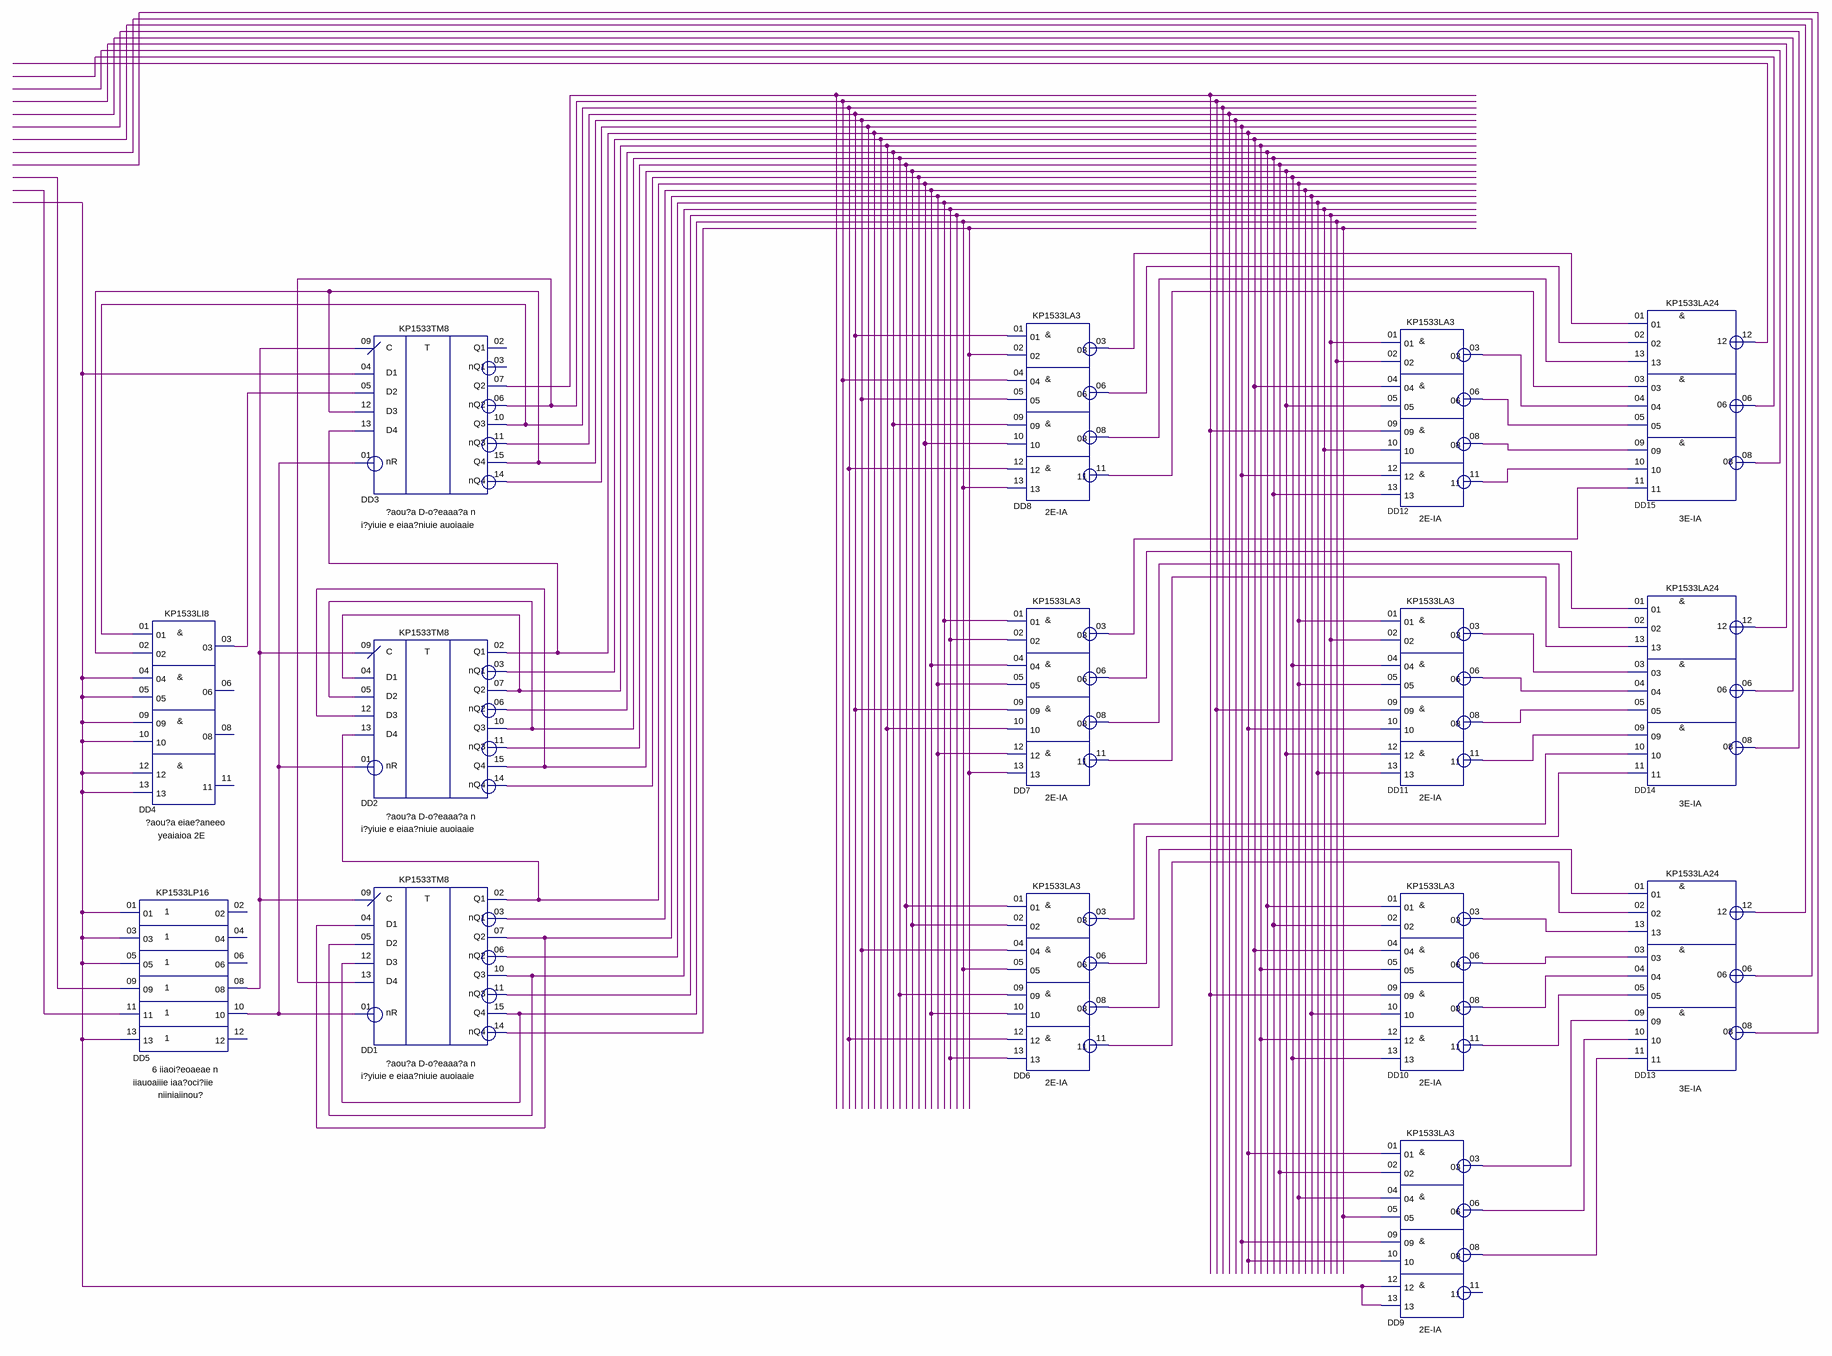
[diagram p0: schematic sheet]
// Quartus schematic principles.bdf as structural Verilog: 15 symbols, 0 pins
module principles (
);

  wire DD1_nq1, DD1_nq2, DD1_nq3, DD1_nq4, DD1_q1, DD1_q2, DD1_q3, DD1_q4, DD2_nq1, DD2_nq2, DD2_nq3,
       DD2_nq4, DD2_q1, DD2_q2, DD2_q3, DD2_q4, DD3_nq2, DD3_nq3, DD3_nq4, DD3_q2, DD3_q3, DD3_q4, DD4_03,
       DD5_08, DD5_10, DD6_03, DD6_06, DD6_08, DD6_11, DD7_03, DD7_06, DD7_08, DD7_11, DD8_03, DD8_06,
       DD8_08, DD8_11, DD9_03, DD9_06, DD9_08, DD10_03, DD10_06, DD10_08, DD10_11, DD11_03, DD11_06, DD11_08,
       DD11_11, DD12_03, DD12_06, DD12_08, DD12_11, DD13_06, DD13_08, DD13_12, DD14_06, DD14_08, DD14_12,
       DD15_06, DD15_08, DD15_12, undriven, undriven_2, undriven_3;

  KP1533LP16 DD5 (
    .\01 (undriven_3), .\03 (undriven_3), .\05 (undriven_3), .\09 (undriven), .\11 (undriven_2),
    .\13 (undriven_3), .\08 (DD5_08), .\10 (DD5_10));  // open: 02, 04, 06, 12
  KP1533LI8 DD4 (
    .\01 (DD3_q3), .\02 (DD3_q4), .\04 (undriven_3), .\05 (undriven_3), .\09 (undriven_3), .\10 (undriven_3),
    .\12 (undriven_3), .\13 (undriven_3), .\03 (DD4_03));  // open: 06, 08, 11
  KP1533TM8 DD3 (
    .nR(DD5_10), .C(DD5_08), .D1(undriven_3), .D2(DD4_03), .D3(DD3_q4), .D4(DD2_q1), .Q2(DD3_q2),
    .nQ2(DD3_nq2), .Q3(DD3_q3), .nQ3(DD3_nq3), .Q4(DD3_q4), .nQ4(DD3_nq4));  // open: Q1, nQ1
  KP1533TM8 DD2 (
    .nR(DD5_10), .C(DD5_08), .D1(DD2_q2), .D2(DD2_q3), .D3(DD2_q4), .D4(DD1_q1), .Q1(DD2_q1), .nQ1(DD2_nq1),
    .Q2(DD2_q2), .nQ2(DD2_nq2), .Q3(DD2_q3), .nQ3(DD2_nq3), .Q4(DD2_q4), .nQ4(DD2_nq4));
  KP1533TM8 DD1 (
    .nR(DD5_10), .C(DD5_08), .D1(DD1_q2), .D2(DD1_q3), .D3(DD1_q4), .D4(DD3_nq2), .Q1(DD1_q1), .nQ1(DD1_nq1),
    .Q2(DD1_q2), .nQ2(DD1_nq2), .Q3(DD1_q3), .nQ3(DD1_nq3), .Q4(DD1_q4), .nQ4(DD1_nq4));
  KP1533LA3 DD8 (
    .\01 (DD3_nq3), .\02 (DD1_nq4), .\04 (DD3_nq2), .\05 (DD3_q4), .\09 (DD2_nq2), .\10 (DD1_q1),
    .\12 (DD3_q3), .\13 (DD1_q4), .\03 (DD8_03), .\06 (DD8_06), .\08 (DD8_08), .\11 (DD8_11));
  KP1533LA3 DD7 (
    .\01 (DD1_nq2), .\02 (DD1_q3), .\04 (DD1_nq1), .\05 (DD1_q2), .\09 (DD3_nq3), .\10 (DD2_q2),
    .\12 (DD1_q2), .\13 (DD1_nq4), .\03 (DD7_03), .\06 (DD7_06), .\08 (DD7_08), .\11 (DD7_11));
  KP1533LA3 DD6 (
    .\01 (DD2_nq3), .\02 (DD2_q4), .\04 (DD3_q4), .\05 (DD1_q4), .\09 (DD2_q3), .\10 (DD1_nq1),
    .\12 (DD3_q3), .\13 (DD1_q3), .\03 (DD6_03), .\06 (DD6_06), .\08 (DD6_08), .\11 (DD6_11));
  KP1533LA3 DD12 (
    .\01 (DD1_nq3), .\02 (DD1_q4), .\04 (DD2_nq1), .\05 (DD2_q4), .\09 (DD3_q2), .\10 (DD1_q3),
    .\12 (DD3_nq4), .\13 (DD2_q3), .\03 (DD12_03), .\06 (DD12_06), .\08 (DD12_08), .\11 (DD12_11));
  KP1533LA3 DD11 (
    .\01 (DD1_q1), .\02 (DD1_nq3), .\04 (DD2_nq4), .\05 (DD1_q1), .\09 (DD3_nq2), .\10 (DD2_q1),
    .\12 (DD2_q4), .\13 (DD1_nq2), .\03 (DD11_03), .\06 (DD11_06), .\08 (DD11_08), .\11 (DD11_11));
  KP1533LA3 DD10 (
    .\01 (DD2_nq2), .\02 (DD2_q3), .\04 (DD2_nq1), .\05 (DD2_q2), .\09 (DD3_q2), .\10 (DD1_q2),
    .\12 (DD2_q2), .\13 (DD2_nq4), .\03 (DD10_03), .\06 (DD10_06), .\08 (DD10_08), .\11 (DD10_11));
  KP1533LA3 DD9 (
    .\01 (DD2_q1), .\02 (DD2_nq3), .\04 (DD1_q1), .\05 (DD1_nq4), .\09 (DD3_nq4), .\10 (DD2_q1),
    .\12 (undriven_3), .\13 (undriven_3), .\03 (DD9_03), .\06 (DD9_06), .\08 (DD9_08));  // open: 11
  KP1533LA24 DD15 (
    .\01 (DD8_03), .\02 (DD8_06), .\13 (DD8_08), .\03 (DD8_11), .\04 (DD12_03), .\05 (DD12_06),
    .\09 (DD12_08), .\10 (DD12_11), .\11 (DD7_03), .\12 (DD15_12), .\06 (DD15_06), .\08 (DD15_08));
  KP1533LA24 DD14 (
    .\01 (DD7_06), .\02 (DD7_08), .\13 (DD7_11), .\03 (DD11_03), .\04 (DD11_06), .\05 (DD11_08),
    .\09 (DD11_11), .\10 (DD6_03), .\11 (DD6_06), .\12 (DD14_12), .\06 (DD14_06), .\08 (DD14_08));
  KP1533LA24 DD13 (
    .\01 (DD6_08), .\02 (DD6_11), .\13 (DD10_03), .\03 (DD10_06), .\04 (DD10_08), .\05 (DD10_11),
    .\09 (DD9_03), .\10 (DD9_06), .\11 (DD9_08), .\12 (DD13_12), .\06 (DD13_06), .\08 (DD13_08));
endmodule
